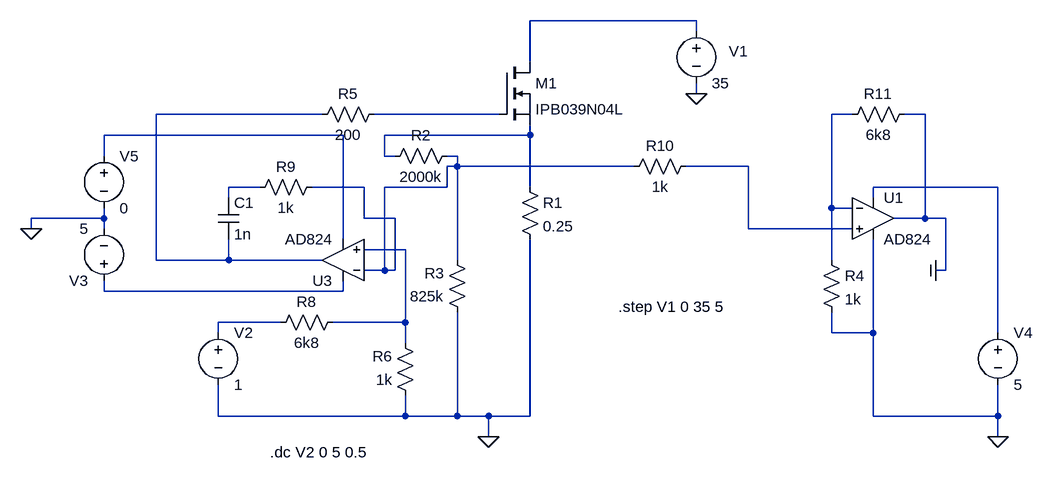
[diagram p0: schematic electronic-load.asc]
electronic-load.asc, the LTspice schematic file:
Version 4
SHEET 1 1420 692
WIRE 416 -144 160 -144
WIRE 416 -128 416 -144
WIRE 160 -80 160 -144
WIRE 416 -32 416 -48
WIRE -160 0 -416 0
WIRE 112 0 -80 0
WIRE 656 0 624 0
WIRE 768 0 736 0
WIRE -128 32 -496 32
WIRE 160 32 160 16
WIRE 160 32 -64 32
WIRE -496 64 -496 32
WIRE -64 64 -64 32
WIRE -48 64 -64 64
WIRE 48 64 32 64
WIRE 48 80 48 64
WIRE 48 80 32 80
WIRE 320 80 48 80
WIRE 496 80 400 80
WIRE -256 112 -304 112
WIRE -96 112 -176 112
WIRE 32 112 32 80
WIRE 32 112 -64 112
WIRE 160 112 160 32
WIRE 880 112 688 112
WIRE -304 128 -304 112
WIRE 688 128 688 112
WIRE 624 144 624 0
WIRE 656 144 624 144
WIRE -496 160 -496 144
WIRE -496 160 -608 160
WIRE -96 160 -96 112
WIRE -48 160 -96 160
WIRE 768 160 768 0
WIRE 768 160 720 160
WIRE 800 160 768 160
WIRE -608 176 -608 160
WIRE -496 176 -496 160
WIRE 496 176 496 80
WIRE 656 176 496 176
WIRE -128 192 -128 32
WIRE -32 208 -96 208
WIRE -416 224 -416 0
WIRE -304 224 -304 192
WIRE -304 224 -416 224
WIRE -160 224 -304 224
WIRE 48 224 48 80
WIRE 624 224 624 144
WIRE -64 240 -64 112
WIRE -64 240 -96 240
WIRE -48 240 -48 160
WIRE -48 240 -64 240
WIRE 800 240 800 160
WIRE 800 240 784 240
WIRE -496 272 -496 256
WIRE -128 272 -128 256
WIRE -128 272 -496 272
WIRE -224 320 -320 320
WIRE -32 320 -32 208
WIRE -32 320 -144 320
WIRE -320 336 -320 320
WIRE 624 336 624 304
WIRE 688 336 688 192
WIRE 688 336 624 336
WIRE 880 336 880 112
WIRE -32 352 -32 320
WIRE -320 464 -320 416
WIRE -32 464 -32 432
WIRE -32 464 -320 464
WIRE 48 464 48 304
WIRE 48 464 -32 464
WIRE 96 464 48 464
WIRE 160 464 160 192
WIRE 160 464 96 464
WIRE 688 464 688 336
WIRE 880 464 880 416
WIRE 880 464 688 464
WIRE 96 496 96 464
WIRE 880 496 880 464
FLAG 96 496 0
FLAG -608 176 0
FLAG 880 496 0
FLAG 416 -32 0
FLAG 784 240 COM
IOPIN 784 240 In
SYMBOL voltage 416 -144 R0
WINDOW 123 0 0 Left 0
WINDOW 39 0 0 Left 0
WINDOW 0 50 47 Left 2
SYMATTR InstName V1
SYMATTR Value 35
SYMBOL voltage -320 320 R0
WINDOW 123 0 0 Left 0
WINDOW 39 0 0 Left 0
SYMATTR InstName V2
SYMATTR Value 1
SYMBOL res 144 96 R0
SYMATTR InstName R1
SYMATTR Value 0.25
SYMBOL voltage -496 272 R180
WINDOW 123 0 0 Left 0
WINDOW 39 0 0 Left 0
SYMATTR InstName V3
SYMATTR Value 5
SYMBOL res 48 48 R90
WINDOW 0 0 56 VBottom 2
WINDOW 3 32 56 VTop 2
SYMATTR InstName R2
SYMATTR Value 2000k
SYMBOL res 64 320 R180
WINDOW 0 36 76 Left 2
WINDOW 3 36 40 Left 2
SYMATTR InstName R3
SYMATTR Value 825k
SYMBOL voltage 880 320 R0
WINDOW 123 0 0 Left 0
WINDOW 39 0 0 Left 0
SYMATTR InstName V4
SYMATTR Value 5
SYMBOL voltage -496 48 R0
WINDOW 123 0 0 Left 0
WINDOW 39 0 0 Left 0
SYMATTR InstName V5
SYMATTR Value 0
SYMBOL nmos 112 -80 R0
SYMATTR InstName M1
SYMATTR Value IPB039N04L
SYMBOL res -64 -16 R90
WINDOW 0 0 56 VBottom 2
WINDOW 3 32 56 VTop 2
SYMATTR InstName R5
SYMATTR Value 200
SYMBOL Opamps\\AD824 -128 288 R180
SYMATTR InstName U3
SYMBOL res -16 448 R180
WINDOW 0 36 76 Left 2
WINDOW 3 36 40 Left 2
SYMATTR InstName R6
SYMATTR Value 1k
SYMBOL res -240 336 R270
WINDOW 0 32 56 VTop 2
WINDOW 3 0 56 VBottom 2
SYMATTR InstName R8
SYMATTR Value 6k8
SYMBOL res -272 128 R270
WINDOW 0 32 56 VTop 2
WINDOW 3 0 56 VBottom 2
SYMATTR InstName R9
SYMATTR Value 1k
SYMBOL cap -320 128 R0
SYMATTR InstName C1
SYMATTR Value 1n
SYMBOL res 304 96 R270
WINDOW 0 32 56 VTop 2
WINDOW 3 0 56 VBottom 2
SYMATTR InstName R10
SYMATTR Value 1k
SYMBOL res 640 16 R270
WINDOW 0 32 56 VTop 2
WINDOW 3 0 56 VBottom 2
SYMATTR InstName R11
SYMATTR Value 6k8
SYMBOL res 608 208 R0
SYMATTR InstName R4
SYMATTR Value 1k
SYMBOL Opamps\\AD824 688 96 R0
SYMATTR InstName U1
TEXT -240 520 Left 2 !.dc V2 0 5 0.5
TEXT 296 296 Left 2 !.step V1 0 35 5

The netlist it stands for:
* electronic-load.asc
V1 N001 0 35
V2 N013 0 1
R1 N006 0 0.25
V3 N012 0 5
R2 N007 N006 2000k
R3 0 N007 825k
V4 N010 0 5
V5 N005 0 0
M1 N001 N003 N006 N006 IPB039N04L
R5 N003 N002 200
XU3 N011 N007 N012 N005 N002 AD824  ; pins In+ In- V+ V- OUT
R6 0 N011 1k
R8 N013 N011 6k8
R9 N009 N007 1k
C1 N009 N002 1n
R10 N007 N008 1k
R11 N004 COM 6k8
R4 N004 0 1k
XU1 N008 N004 N010 0 COM AD824  ; pins In+ In- V+ V- OUT
.model NMOS NMOS
.model PMOS PMOS
.lib standard.mos
.dc V2 0 5 0.5
.step V1 0 35 5
.backanno
.end

* Results of the author's LTspice run, read from the files saved beside the schematic
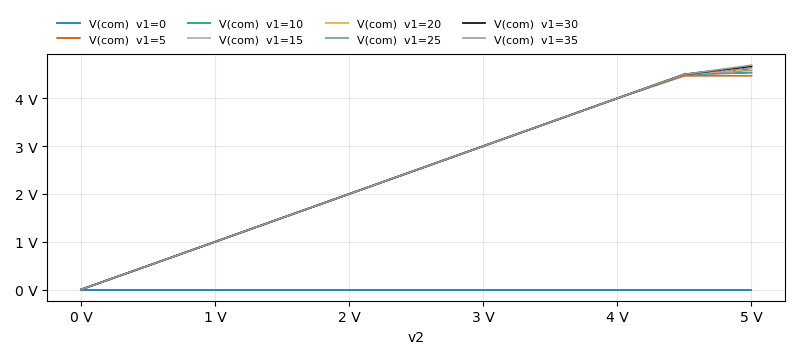
[diagram p1: DC transfer characteristic of electronic-load.asc, plotted from the saved traces]
* DC transfer characteristic, 8 runs:
*   V(com) [v1=0]: 3.037 mV at v2=0 V, 3.037 mV at v2=5 V, min 3.037 mV, max 3.037 mV
*   V(com) [v1=5]: 3.037 mV at v2=0 V, 4.47 V at v2=5 V, min 3.037 mV, max 4.47 V
*   V(com) [v1=10]: 3.037 mV at v2=0 V, 4.535 V at v2=5 V, min 3.037 mV, max 4.535 V
*   V(com) [v1=15]: 3.037 mV at v2=0 V, 4.581 V at v2=5 V, min 3.037 mV, max 4.581 V
*   V(com) [v1=20]: 3.037 mV at v2=0 V, 4.617 V at v2=5 V, min 3.037 mV, max 4.617 V
*   V(com) [v1=25]: 3.037 mV at v2=0 V, 4.646 V at v2=5 V, min 3.037 mV, max 4.646 V
*   V(com) [v1=30]: 3.037 mV at v2=0 V, 4.67 V at v2=5 V, min 3.037 mV, max 4.67 V
*   V(com) [v1=35]: 3.037 mV at v2=0 V, 4.691 V at v2=5 V, min 3.037 mV, max 4.691 V